# EAGLE design CHARLIEplexing-with-THE-UNICORN (EAGLE 5.04)
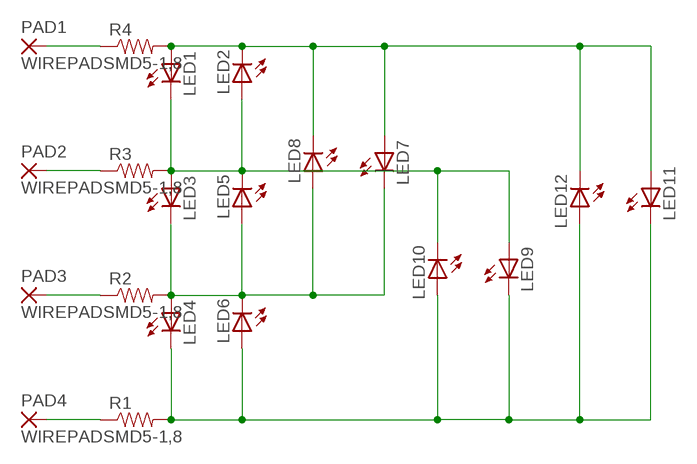
[diagram p0: schematic, sheet 1]

## Parts
LED1  LED1206  [LED-1206]
LED2  LED1206  [LED-1206]
LED3  LED1206  [LED-1206]
LED4  LED1206  [LED-1206]
LED5  LED1206  [LED-1206]
LED6  LED1206  [LED-1206]
LED7  LED1206  [LED-1206]
LED8  LED1206  [LED-1206]
LED9  LED1206  [LED-1206]
LED10  LED1206  [LED-1206]
LED11  LED1206  [LED-1206]
LED12  LED1206  [LED-1206]
PAD1  WIREPADSMD5-1,8  [5-1,8]
PAD2  WIREPADSMD5-1,8  [5-1,8]
PAD3  WIREPADSMD5-1,8  [5-1,8]
PAD4  WIREPADSMD5-1,8  [5-1,8]
R1  RESISTOR1206  [1206]
R2  RESISTOR1206  [1206]
R3  RESISTOR1206  [1206]
R4  RESISTOR1206  [1206]

## Nets
N$1: PAD4.1(P) R1.1
N$2: PAD3.1(P) R2.1
N$3: PAD2.1(P) R3.1
N$4: LED4.C LED6.A LED9.C LED10.A LED11.C LED12.A R1.2
N$5: PAD1.1(P) R4.1
N$9: LED3.C LED4.A LED5.A LED6.C LED7.C LED8.A R2.2
N$11: LED1.C LED2.A LED3.A LED5.C LED9.A LED10.C R3.2
N$13: LED1.A LED2.C LED7.A LED8.C LED11.A LED12.C R4.2

## Library data of the parts
LED1-LED12 = SparkFun:LED: LEDs Standard schematic elements and footprints for 5mm, 3mm, 1206, and 0603 sized LEDs. 5mm - Spark Fun Electronics SKU : COM-00529 (and others)
PAD1-PAD4 = wirepad:WIREPAD: Wire PAD connect wire on PCB
R1-R4 = SparkFun:RESISTOR: Resistor Basic schematic elements and footprints for 0603, 1206, and PTH 1/10th watt (small) resistors.

## Board
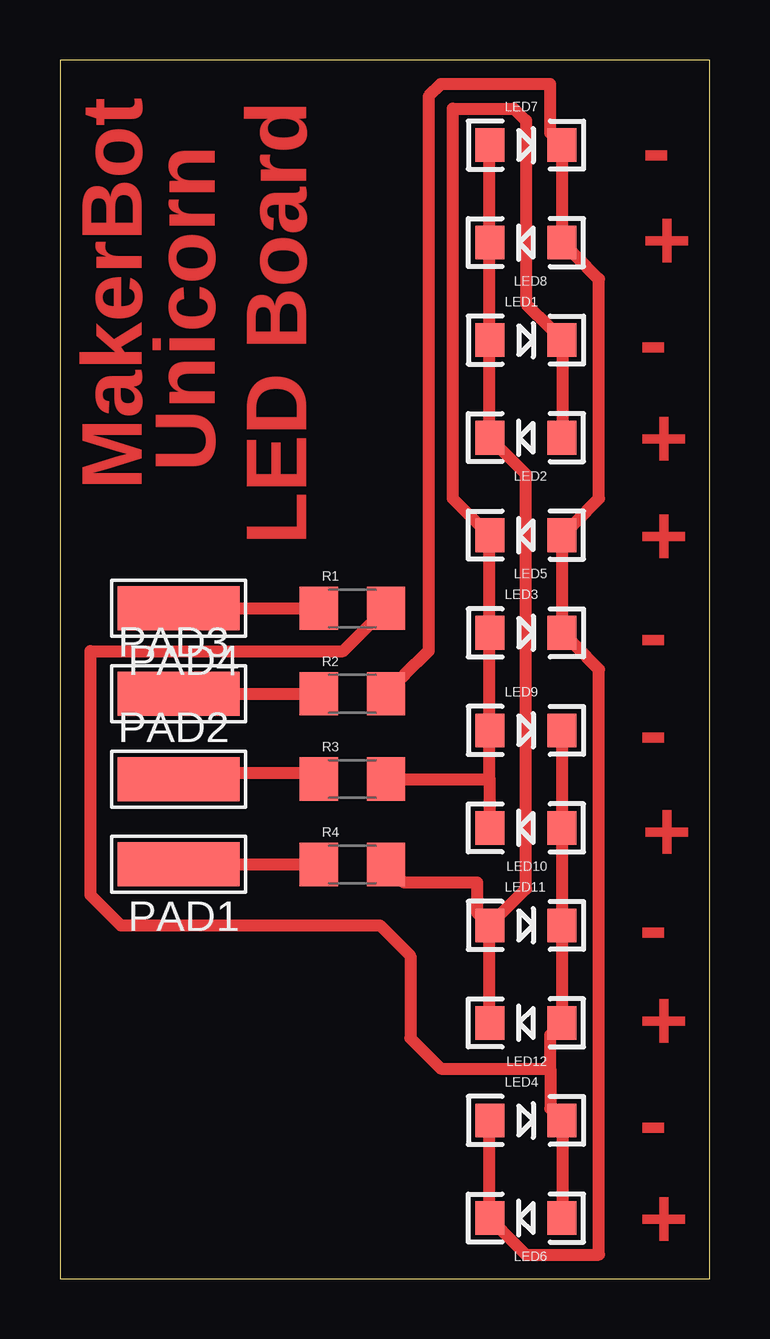
[diagram p1: board, top side]

Size 27.1 x 50.79 mm. Coordinates in mm from the lower left corner, seen from the top.
Outline: 0,0 27.1,0 27.1,50.79 0,50.79 0,0
Copper layers (1*16): Top 0.035mm / dielectric 1.5mm / Bottom 0.035mm
Design rules "SparkFun *": minimum track width 20mil, minimum drill 20mil, track to track 20mil, track to pad 20mil, pad to pad 20mil, via to via 20mil, smd to smd 8mil, copper to edge 10mil, drill to drill 8mil, minimum pad ring 12mil, minimum via ring 10mil, stop-mask expansion 4mil, vias tented up to drill 25mil, thermal gap 10mil

### Footprints (pad centres in the part's own frame; a part is rotated, then mirrored left to right if it is on the bottom)
LED-1206 = smd 1.2 x 1.4: A -1.5,0; C 1.5,0
5-1,8 = smd 1.829 x 5.08: 1 0,0
1206 = smd 1.6 x 1.8: 1 -1.4,0; 2 1.4,0

### Placement (x,y rotation side)
LED1  19.43,39.12 0 top
LED2  19.43,35.05 180 top
LED3  19.43,26.92 0 top
LED4  19.43,6.6 0 top
LED5  19.43,30.99 180 top
LED6  19.43,2.54 180 top
LED7  19.43,47.24 0 top
LED8  19.43,43.18 180 top
LED9  19.43,22.86 0 top
LED10  19.43,18.8 180 top
LED11  19.43,14.73 0 top
LED12  19.43,10.67 180 top
PAD1  4.95,17.27 90 top
PAD2  4.95,20.83 270 top
PAD3  4.95,24.38 270 top
PAD4  4.95,27.94 90 top
R1  12.19,27.94 0 top
R2  12.19,24.38 0 top
R3  12.19,20.83 0 top
R4  12.19,17.27 0 top

### Tracks (layer width: path | path; a pad name or v marks a point on that pad's centre or on a via)
N$1
  Top 0.508: PAD4.1 R1.1
N$2
  Top 0.508: PAD3.1 R2.1
N$3
  Top 0.508: R3.1 10.03,21.08 7.24,21.08 PAD2.1
N$4
  Top 0.508: LED9.C 20.95,22.35 20.95,19.3 LED10.A 20.95,18.29 20.95,15.24 LED11.C 20.95,14.22 20.95,11.18 LED12.A 20.45,10.16 20.45,8.76 | LED6.A 20.95,3.05 20.95,6.1 LED4.C 20.45,7.11 20.45,8.76 | 20.45,8.76 15.88,8.76 14.61,10.03 14.61,13.46 13.34,14.73 2.54,14.73 1.27,16 1.27,26.16 11.81,26.16 12.83,27.18 R1.2
N$5
  Top 0.508: PAD1.1 R4.1
N$9
  Top 0.508: R2.2 14.35,25.15 15.37,26.16 15.37,49.28 15.88,49.78 20.45,49.78 20.45,47.75 LED7.C 20.95,46.74 20.95,43.69 LED8.A 21.46,42.67 22.48,41.66 22.48,32.51 21.46,31.5 LED5.A 20.95,30.48 20.95,27.43 LED3.C 21.46,26.42 22.48,25.4 22.48,1.02 19.43,1.02 18.41,2.03 LED6.C 17.91,3.05 17.91,6.1 LED4.A
N$11
  Top 0.508: LED2.A 20.95,35.56 20.95,38.61 LED1.C 20.45,39.62 19.43,40.64 19.43,48.26 18.92,48.77 16.38,48.77 16.38,32.51 17.4,31.5 LED5.C 17.91,30.48 17.91,27.43 LED3.A 17.91,26.42 17.91,23.37 LED9.A 17.91,22.35 17.91,20.83 | 17.91,20.83 17.91,19.3 LED10.C | R3.2 17.91,20.83
N$13
  Top 0.508: LED12.C 17.91,11.18 17.91,14.22 LED11.A | R4.2 14.35,16.51 17.4,16.51 17.4,15.24 LED11.A | LED7.A 17.91,46.74 17.91,43.69 LED8.C 17.91,42.67 17.91,39.62 LED1.A 17.91,38.61 17.91,35.56 LED2.C 18.41,34.54 19.43,33.53 19.43,16.26 18.41,15.24 LED11.A

### Text on the board
Top: - | + | Board | - | Unicorn | + | MakerBot | LED | + | - | - | + | - | + | - | +